# Altium project ArmbandControllerHardware_RevA.PrjPcb
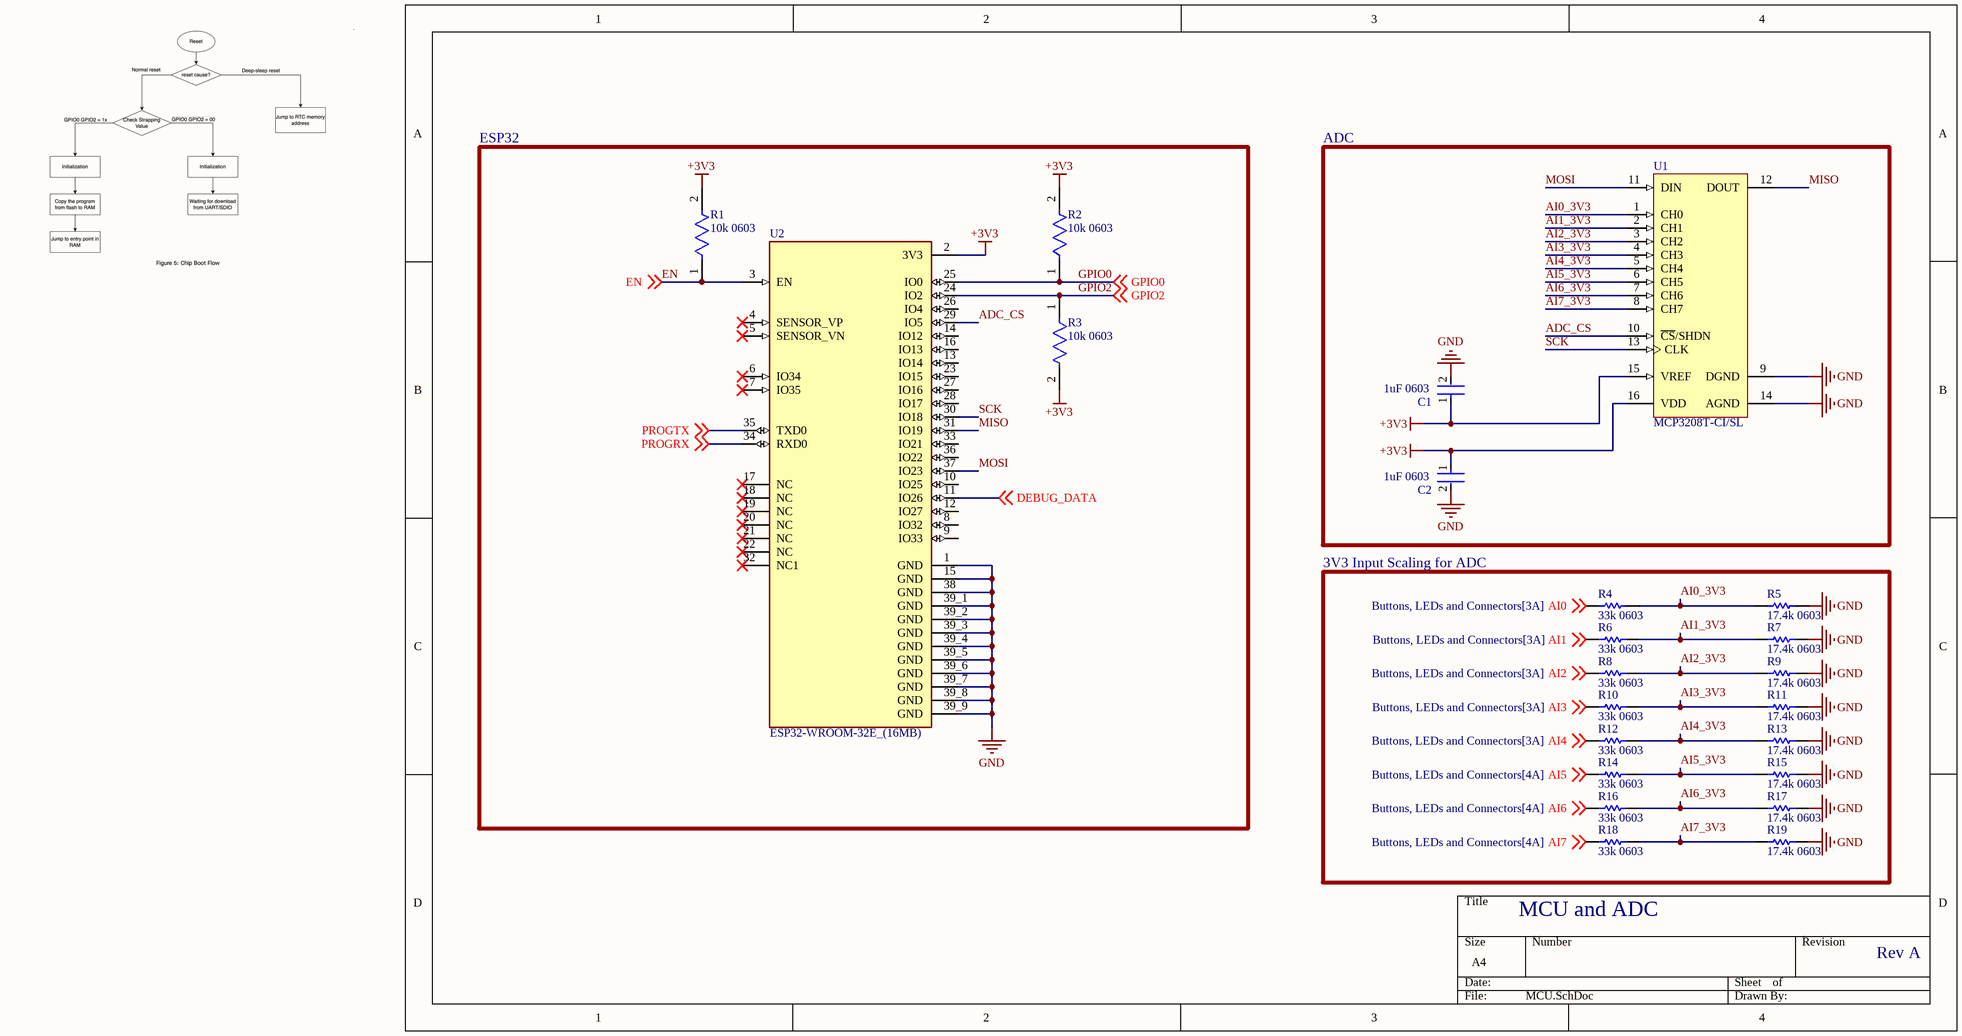
[diagram p0: MCU.SchDoc]
3 sheets, 48 parts. Net scope: global (net labels, ports and power ports of the same name join across sheets).
Board file: ArmbandControllerHardware PCB_RevA.PcbDoc
Sheets:
  MCU.SchDoc
  Buttons, LEDs and Connectors.SchDoc
  Power Schematic.SchDoc

## Sheet MCU.SchDoc
size A4; SheetNumber: 1; SheetTotal: 3

### Parts
C1  1uF 0603  [FP-CC0603-DA-MFG]
C2  1uF 0603  [FP-CC0603-DA-MFG]
R1  10k 0603  [FP-RC0603-0_55-IPC_C]
R2  10k 0603  [FP-RC0603-0_55-IPC_C]
R3  10k 0603  [FP-RC0603-0_55-IPC_C]
R4  33k 0603  [RESC1608X55X25LL10T15]
R5  17.4k 0603  [RESC1608X55X25NL10T15]
R6  33k 0603  [RESC1608X55X25LL10T15]
R7  17.4k 0603  [RESC1608X55X25NL10T15]
R8  33k 0603  [RESC1608X55X25LL10T15]
R9  17.4k 0603  [RESC1608X55X25NL10T15]
R10  33k 0603  [RESC1608X55X25LL10T15]
R11  17.4k 0603  [RESC1608X55X25NL10T15]
R12  33k 0603  [RESC1608X55X25LL10T15]
R13  17.4k 0603  [RESC1608X55X25NL10T15]
R14  33k 0603  [RESC1608X55X25LL10T15]
R15  17.4k 0603  [RESC1608X55X25NL10T15]
R16  33k 0603  [RESC1608X55X25LL10T15]
R17  17.4k 0603  [RESC1608X55X25NL10T15]
R18  33k 0603  [RESC1608X55X25LL10T15]
R19  17.4k 0603  [RESC1608X55X25NL10T15]
U1  MCP3208T-CI/SL  [SOIC-SL16_L]
U2  ESP32-WROOM-32E_(16MB)  [XCVR_ESP32-WROOM-32E_(16MB)]

### Blocks framed on the sheet
ESP32: R1-R3 U2
ADC: C1 C2 U1
3V3 Input Scaling for ADC: R4-R19

### Nets
+3V3: C1.1 C2.1 R1.2 R2.2 R3.2 U1.15(VREF) U1.16(VDD) U2.2(3V3)
GND: C1.2 C2.2 R5.1 R7.1 R9.1 R11.1 R13.1 R15.1 R17.1 R19.1 U1.9(DGND) U1.14(AGND) U2.1(GND) U2.15(GND) U2.38(GND) U2.39_1(GND) U2.39_2(GND) U2.39_3(GND) U2.39_4(GND) U2.39_5(GND) U2.39_6(GND) U2.39_7(GND) U2.39_8(GND) U2.39_9(GND)
ADC_CS: U1.10(~{CS}/SHDN) U2.29(IO5)
AI0: R4.1 ; off-sheet AI0
AI0_3V3: R4.2 R5.2 U1.1(CH0)
AI1: R6.1 ; off-sheet AI1
AI1_3V3: R6.2 R7.2 U1.2(CH1)
AI2: R8.1 ; off-sheet AI2
AI2_3V3: R8.2 R9.2 U1.3(CH2)
AI3: R10.1 ; off-sheet AI3
AI3_3V3: R10.2 R11.2 U1.4(CH3)
AI4: R12.1 ; off-sheet AI4
AI4_3V3: R12.2 R13.2 U1.5(CH4)
AI5: R14.1 ; off-sheet AI5
AI5_3V3: R14.2 R15.2 U1.6(CH5)
AI6: R16.1 ; off-sheet AI6
AI6_3V3: R16.2 R17.2 U1.7(CH6)
AI7: R18.1 ; off-sheet AI7
AI7_3V3: R18.2 R19.2 U1.8(CH7)
DEBUG_DATA: U2.11(IO26) ; off-sheet DEBUG_DATA
EN: R1.1 U2.3(EN) ; off-sheet EN
GPIO0: R2.1 U2.25(IO0) ; off-sheet GPIO0
GPIO2: R3.1 U2.24(IO2) ; off-sheet GPIO2
MISO: U1.12(DOUT) U2.31(IO19)
MOSI: U1.11(DIN) U2.37(IO23)
PROGRX: U2.34(RXD0) ; off-sheet PROGRX
PROGTX: U2.35(TXD0) ; off-sheet PROGTX
SCK: U1.13(CLK) U2.30(IO18)

Not connected (* = marked no-connect by the designer): U2 4(SENSOR_VP)* 5(SENSOR_VN)* 6(IO34)* 7(IO35)* 8(IO32) 9(IO33) 10(IO25) 12(IO27) 13(IO14) 14(IO12) 16(IO13) 17(NC)* 18(NC)* 19(NC)* 20(NC)* 21(NC)* 22(NC)* 23(IO15) 26(IO4) 27(IO16) 28(IO17) 32(NC1)* 33(IO21) 36(IO22)

### Notes on the sheet
- MCU and ADC
- Rev A

### Library data of the parts
C1 C2 = CMP-03422-000612-1: CAP CER 1UF 25V X5R 0603; Manufacturer: YAGEO; Manufacturer Part Number: CC0603KRX5R8BB105; Material: Ceramic; Tolerance: 0.1; Temperature Coefficient: 15%; Automotive: No; Octopart: https://octopart.com/cc0603krx5r8bb105-yageo-9292811; Package: CC0603-DA; Temperature Range High: +125°C; Digikey Description: CAP CER 1UF 25V X5R 0603; Mouser Description: Multilayer Ceramic Capacitors MLCC - SMD/SMT 1.0uF 25V X5R 10%; Device Class L2: Capacitors; Category: Cap; Value: 1 uF; Temperature: -55°C to +125°C; ComponentLink2URL: http://www.yageo.com/documents/recent/UPY-GPHC_X7R_6.3V-to-50V_18.pdf; Capacitance: 1 uF; ComponentLink2Description: Datasheet; Voltage: 25 V; Height: 0.9mm; Device Class L3: Ceramic Capacitors; Temperature Characteristic: X5R; Footprint Url: http://www.yageo.com/exep/pages/download/literatures/UPY-C_GEN_24.pdf; Temperature Range Low: -55°C; Device Class L1: Passive Components; Voltage Rating: 25 V; Lead Free: Yes; RoHS: TRUE
R1-R3 = CMP-2100-03664-2: RES 10K OHM 1% 1/10W 0603; Voltage Rating: 75V; Voltage Rating (DC): 50V; Resistance: 10kR; Power Rating: 100mW; Temperature Coefficient: 100ppm/°C; Depth: 0.8mm; Termination: SMD/SMT; Resistor Type: Thick Film; Series: RC; Construction: Rectangular; Features: Moisture Resistant; Packaging: Tape and Reel; Min Operating Temperature: -55°C; Number of Terminations: 2; Lead Pitch: 0.3mm; RoHS Compliant: Yes; Case/Package: 0603; Resistance Tolerance: 1%; Military Standard: Not; Weight: 7.1E-05oz; Number of Pins: 2; Tolerance: 1%; Length: 1.6mm; Case Code (Imperial): 0603; Lead Free: Lead Free; Width: 0.8mm; Max Power Dissipation: 100mW; Height: 0.45mm; Max Operating Temperature: 155°C; Case Code (Metric): 1608; Size Code: 0603
R4 R6 R8 R10 R12 R14 R16 R18 = CMP-2000-06939-1: Chip Resistor, 33 Ohm, +/- 1%, 0.1 W, -55 to 155 degC, 0603 (1608 Metric), RoHS, Tape and Reel; Temperature Coefficient: 100PPM/C; Voltage Rating: 75V; Unit Weight: 0.000071oz; Power Rating: 100mW; Brand: Yageo; Resistance: 33Ohms; Product Category: ThickFilmResistors; Packaging: Reel; Tolerance: 1%; RoHS: True; Height: 0.45mm; Case Code - mm: 1608; Series: RC; Datasheet URL: http://www.yageo.com/documents/recent/PYu-RC_Group_51_RoHS_L_7.pdf; Operating Temperature Range: -55Cto+155C; Type: GeneralPurposeChipResistorSurfaceMount; Product: ThickFilmResistorsGeneralPurpose; Package / Case: 0603(1608metric); Width: 0.8mm; Length: 1.6mm; Case Code - in: 0603; Mounting Technology: SurfaceMount; Manufacturer URL: http://www.yageo.com/; Manufacturer: Yageo; Package Reference: 0603; Termination Style: SMD/SMT; Datasheet Version: Rev. 7, 05/2017; Package Description: 2-Pin Surface Mount Device, Body 1.6 x 0.8 mm
R5 R7 R9 R11 R13 R15 R17 R19 = CMP-2000-03920-1: Part Number: RC0603FR-0717K4L; Manufacturer: Yageo
U1 = CMP-0188-00450-2: 2.7V 4-Channel/8-Channel 12-Bit A/D Converters with SPI Serial Interface, 16-Pin SOIC 150mil, C Performance Grade, Industrial Temperature, Tape and Reel; PackageDescription: 16-Lead Plastic Small Outline (SL) - Narrow, 3.90mm Body [SOIC]; ComponentLink3Description: Package Specification; PackageReference: SOIC-SL16; ComponentLink1Description: Manufacturer URL; ComponentLink2URL: http://ww1.microchip.com/downloads/en/DeviceDoc/21298e.pdf; ComponentLink1URL: http://www.microchip.com/; Code_JEDEC: MS-012-AC; ComponentLink3URL: http://www.microchip.com/stellent/groups/techpub_sg/documents/packagingspec/en012702.pdf; Code_IPC: SOIC127P600-16; ComponentLink2Description: Datasheet; RevisionNote: URLs added.; PackageVersion: revBB, Aug-2009; DatasheetVersion: revE, Sep-2008
U2 = ESP32-WROOM-32E_(16MB): MF: {'manufacturer': u'Espressif Systems'}; Package: None; Price: None; Value: *; MP: ESP32-WROOM-32E_(16MB); Availability: Unavailable

## Sheet Buttons, LEDs and Connectors.SchDoc
size A4; SheetNumber: 2; SheetTotal: 3
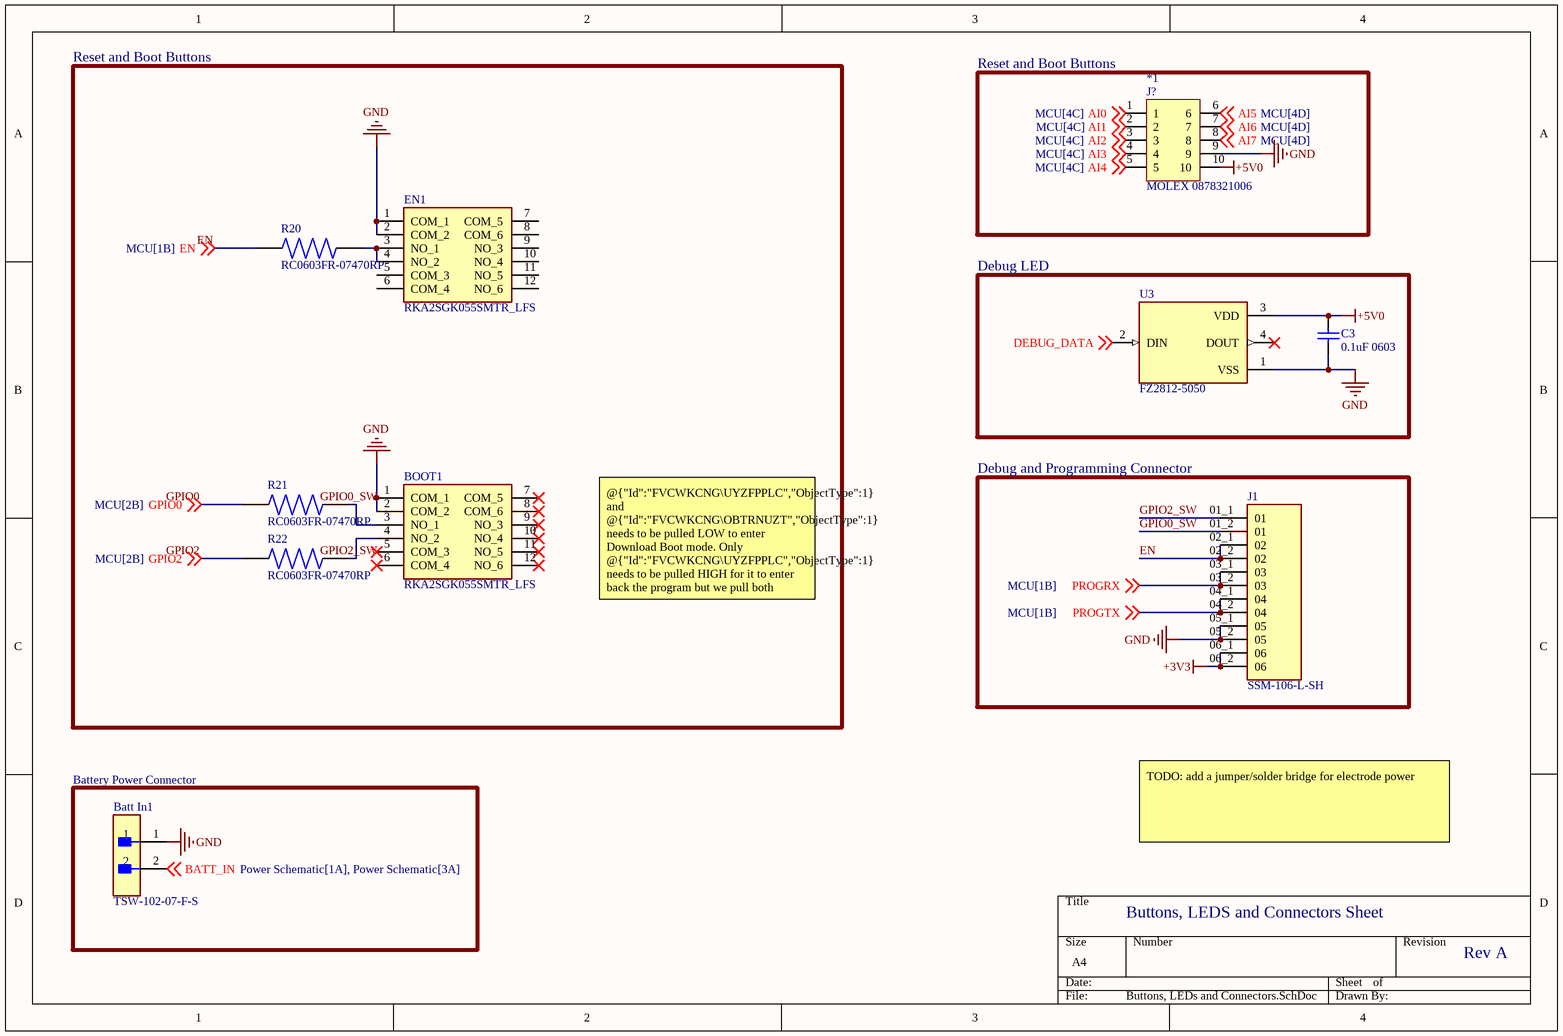
[diagram p1: Buttons, LEDs and Connectors.SchDoc]

### Parts
*1  MOLEX 0878321006  [MOLEX 0878321006]
Batt_In1  TSW-102-07-F-S  [FP-TSW-102-07-F-S-MFG]
BOOT1  RKA2SGK055SMTR_LFS  [RKA2SGK055SMTRLFS]
C3  0.1uF 0603  [CAPC1608X90X40LL10T20]
EN1  RKA2SGK055SMTR_LFS  [RKA2SGK055SMTRLFS]
J1  SSM-106-L-SH  [SAMTEC_SSM-106-L-SH]
R20  RC0603FR-07470RP  [RESC1608X55N]
R21  RC0603FR-07470RP  [RESC1608X55N]
R22  RC0603FR-07470RP  [RESC1608X55N]
U3  FZ2812-5050  [LED_FZ2812-5050]

### Blocks framed on the sheet
Reset and Boot Buttons: BOOT1 EN1 R20-R22
Reset and Boot Buttons: *1
Debug LED: C3 U3
Debug and Programming Connector: J1
Battery Power Connector: Batt_In1

### Nets
+3V3: J1.06_1(06) J1.06_2(06)
+5V0: *1.10 C3.2 U3.3(VDD)
GND: *1.9 Batt_In1.1 BOOT1.1(COM_1) BOOT1.2(COM_2) C3.1 EN1.1(COM_1) EN1.2(COM_2) J1.05_1(05) J1.05_2(05) U3.1(VSS)
AI0: *1.1 ; off-sheet AI0
AI1: *1.2 ; off-sheet AI1
AI2: *1.3 ; off-sheet AI2
AI3: *1.4 ; off-sheet AI3
AI4: *1.5 ; off-sheet AI4
AI5: *1.6 ; off-sheet AI5
AI6: *1.7 ; off-sheet AI6
AI7: *1.8 ; off-sheet AI7
BATT_IN: Batt_In1.2 ; off-sheet BATT_IN
DEBUG_DATA: U3.2(DIN) ; off-sheet DEBUG_DATA
EN: J1.02_1(02) J1.02_2(02) R20.2 ; off-sheet EN
GPIO0: R21.2 ; off-sheet GPIO0
GPIO0_SW: BOOT1.3(NO_1) J1.01_2(01) R21.1
GPIO2: R22.2 ; off-sheet GPIO2
GPIO2_SW: BOOT1.4(NO_2) J1.01_1(01) R22.1
PROGRX: J1.03_1(03) J1.03_2(03) ; off-sheet PROGRX
PROGTX: J1.04_1(04) J1.04_2(04) ; off-sheet PROGTX
NetEN1_3: EN1.3(NO_1) EN1.4(NO_2) R20.1

Not connected (* = marked no-connect by the designer): BOOT1 5(COM_3)* 6(COM_4)* 7(COM_5)* 8(COM_6)* 9(NO_3)* 10(NO_4)* 11(NO_5)* 12(NO_6)*; EN1 5(COM_3) 6(COM_4) 7(COM_5) 8(COM_6) 9(NO_3) 10(NO_4) 11(NO_5) 12(NO_6); U3 4(DOUT)*

### Notes on the sheet
- @{"Id":"FVCWKCNG\UYZFPPLC","ObjectType":1} and @{"Id":"FVCWKCNG\OBTRNUZT","ObjectType":1}
  needs to be pulled LOW to enter Download Boot mode. Only @{"Id":"FVCWKCNG\UYZFPPLC","ObjectType":1} needs to be pulled HIGH for it to enter back the program but we pull both @{"Id":"FVCWKCNG\UYZFPPLC","ObjectType":1} and @{"Id":"FVCWKCNG\OBTRNUZT","ObjectType":1} HIGH for simplicity
- TODO: add a jumper/solder bridge for electrode power
- Buttons, LEDS and Connectors Sheet
- Rev A
- (in symbol MOLEX 0878321006) J?

### Library data of the parts
Batt_In1 = CMP-02766-001458-1: CONN HEADER VERT 2POS 2.54MM; Gender: Male; Max Current Rating: 7.6A; Number of Contacts: 2; Max Voltage Rating (AC): 550V; Orientation: Straight; Depth: 2.54mm; Series: TSW; Package Quantity: 1; Min Operating Temperature: -55°C; Max Operating Temperature: 125°C; Contact Type: Male Pin; Contact Shape: Square; Color: Black; Housing Color: Black; Connector Type: Header; Fastening Type: Pull; Radiation Hardening: No; Pitch: 2.54mm; Housing Material: Polyester; Mount: Through Hole; Number of Positions: 2; Number of Rows: 1; Contact Material: Bronze; Insulation Color: Black; Contact Finish - Mating: GOLD; Termination: Solder; Insulation Material: PBT; Length: 5.08mm; Flammability Rating: UL94 V-0; Contact Mating Length: 0.23inch; REACH SVHC: No SVHC; Contact Plating: Gold; RoHS Compliant: Yes; Packaging: Bulk
BOOT1 EN1 = RKA2SGK055SMTR_LFS: Switch; Manufacturer_Name: C & K COMPONENTS; Manufacturer_Part_Number: RKA2SGK055SMTR LFS; Datasheet Link: https://www.ckswitches.com/media/3130/ck_rk_datasheet.pdf; Height: 0.55mm; Mouser Part Number: 611-RKA2SGK055SMTRLF; Mouser Price/Stock: https://www.mouser.co.uk/ProductDetail/CK/RKA2SGK055SMTR-LFS?qs=iLbezkQI%252BsiGAt%252Bzcl2zSQ%3D%3D; Arrow Part Number: RKA2SGK055SMTR LFS; Arrow Price/Stock: https://www.arrow.com/en/products/rka2sgk055smtr-lfs/ck?region=europe
C3 = CMP-1035-02594-2: Chip Capacitor, 100 nF, - 20% to + 80%, 50 V, -30 to 85 degC, 0603 (1608 Metric), RoHS, Tape and Reel; Manufacturer: Yageo; Tolerance: -20%,+80%; Capacitance: 0.1µF; Product Training Modules: MultilayerCeramicCapacitors; Temperature Coefficient: Y5V(F); Kits: CC060300000000000-ND-MLCC0603SAMPLEKIT; Other Names: 311-1343-1; Featured Product: CommodityMultilayerCeramicCapacitors–CCSeries; Online Catalog: CCSeries; Voltage - Rated: 50V; Mounting Type: SurfaceMount,MLCC; Package Description: 2-Pin Surface Mount Device, Body 1.6 x 0.8 mm; Ratings: -; Lead Spacing: -; Standard Package: 1; Applications: GeneralPurpose; Size / Dimension: 0.063"Lx0.031"W(1.60mmx0.80mm); Package Reference: 0603; Operating Temperature: -30°C~85°C; Features: -; Height - Seated (Max): -; Thickness (Max): 0.035"(0.90mm); Series: CC; Datasheet URL: https://datasheet.ciiva.com/17434/upy-gphc-y5v-6-3v-to-50v-5-17434523.pdf; Family: CeramicCapacitors; Mounting Technology: SurfaceMount; Packaging: CutTape(CT); Package / Case: 0603(1608Metric); Manufacturer URL: http://www.yageo.com/; Category: Capacitors; Lead Style: -; Datasheet Version: Rev. 5, 07/2010
J1 = SSM-106-L-SH: MF: {'manufacturer': u'Samtec'}; Package: None; Price: None; Value: *; MP: SSM-106-L-SH; Availability: Unavailable
R20-R22 = RC0603FR-07470RP: RES SMD 470 OHM 1% 1/10W 0603; MF: {'manufacturer': u'Yageo Corporation'}; Package: None; Price: None; Value: *; MP: RC0603FR-07470RP; Availability: Unavailable
U3 = FZ2812-5050: MF: {'manufacturer': u'Feztek'}; Package: None; Price: None; Value: *; MP: FZ2812-5050; Availability: Unavailable

## Sheet Power Schematic.SchDoc
size A4; SheetNumber: 3; SheetTotal: 3
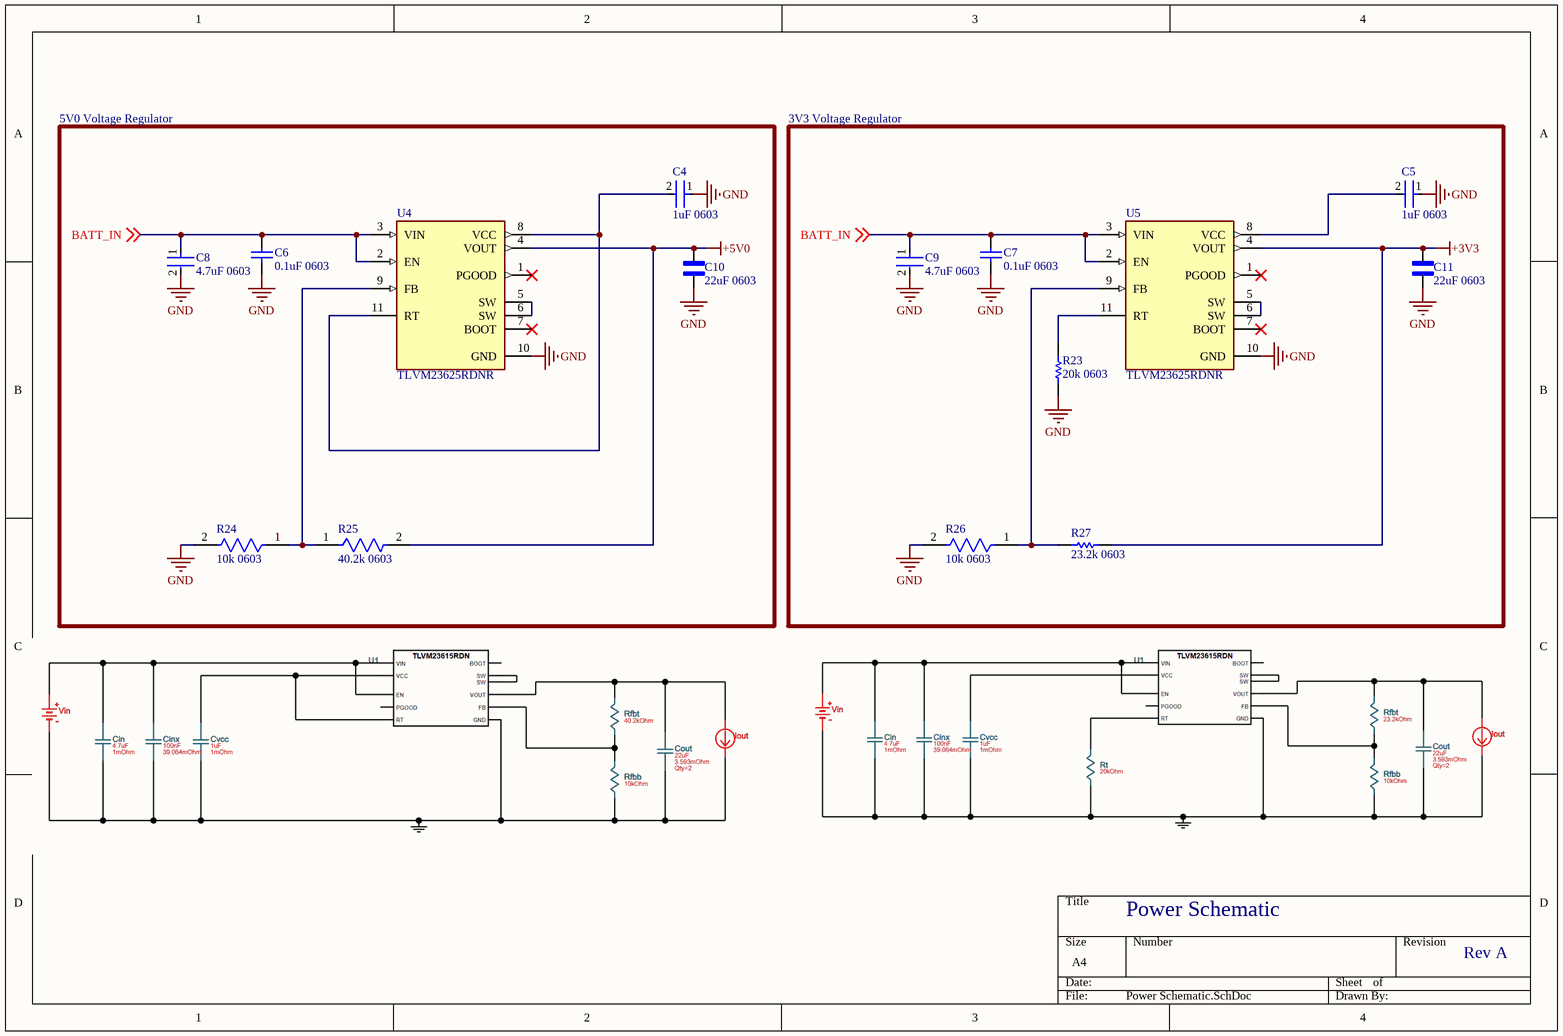
[diagram p2: Power Schematic.SchDoc]

### Parts
C4  1uF 0603  [FP-CC0603-DA-MFG]
C5  1uF 0603  [FP-CC0603-DA-MFG]
C6  0.1uF 0603  [CAPC1608X90X40LL10T20]
C7  0.1uF 0603  [CAPC1608X90X40LL10T20]
C8  4.7uF 0603  [FP-CC0603-DA-MFG]
C9  4.7uF 0603  [FP-CC0603-DA-MFG]
C10  22uF 0603  [CAPC1608X90]
C11  22uF 0603  [CAPC1608X90]
R23  20k 0603  [RESC1608X55X25NL10T15]
R24  10k 0603  [FP-RC0603-0_55-IPC_C]
R25  40.2k 0603  [FP-RC0603-0_55-IPC_C]
R26  10k 0603  [FP-RC0603-0_55-IPC_C]
R27  23.2k 0603  [RESC1608X55X25NL10T15]
U4  TLVM23625RDNR  [CONV_TLVM23625RDNR]
U5  TLVM23625RDNR  [CONV_TLVM23625RDNR]

### Blocks framed on the sheet
5V0 Voltage Regulator: C4 C6 C8 C10 R24 R25 U4
3V3 Voltage Regulator: C5 C7 C9 C11 R23 R26 R27 U5

### Nets
+3V3: C11.1 R27.2 U5.4(VOUT)
+5V0: C10.1 R25.2 U4.4(VOUT)
GND: C4.1 C5.1 C6.1 C7.1 C8.2 C9.2 C10.2 C11.2 R23.1 R24.2 R26.2 U4.10(GND) U5.10(GND)
BATT_IN: C6.2 C7.2 C8.1 C9.1 U4.2(EN) U4.3(VIN) U5.2(EN) U5.3(VIN) ; off-sheet BATT_IN
NetC4_2: C4.2 U4.8(VCC) U4.11(RT)
NetC5_2: C5.2 U5.8(VCC)
NetR23_2: R23.2 U5.11(RT)
NetR24_1: R24.1 R25.1 U4.9(FB)
NetR26_1: R26.1 R27.1 U5.9(FB)
NetU4_5: U4.5(SW) U4.6(SW)
NetU5_5: U5.5(SW) U5.6(SW)

Not connected (* = marked no-connect by the designer): U4 1(PGOOD)* 7(BOOT)*; U5 1(PGOOD)* 7(BOOT)*

### Notes on the sheet
- Power Schematic
- Rev A

### Library data of the parts
C4 C5 = CMP-03422-000612-1: as C1 on sheet MCU; Automotive: No; Octopart: https://octopart.com/cc0603krx5r8bb105-yageo-9292811; Package: CC0603-DA; Temperature Range High: +125°C; Digikey Description: CAP CER 1UF 25V X5R 0603; Mouser Description: Multilayer Ceramic Capacitors MLCC - SMD/SMT 1.0uF 25V X5R 10%; Device Class L2: Capacitors; Category: Cap; Value: 1 uF; Temperature: -55°C to +125°C; ComponentLink2URL: http://www.yageo.com/documents/recent/UPY-GPHC_X7R_6.3V-to-50V_18.pdf; Capacitance: 1 uF; ComponentLink2Description: Datasheet; Voltage: 25 V; Height: 0.9mm; Device Class L3: Ceramic Capacitors; Temperature Characteristic: X5R; Footprint Url: http://www.yageo.com/exep/pages/download/literatures/UPY-C_GEN_24.pdf; Temperature Range Low: -55°C; Device Class L1: Passive Components; Voltage Rating: 25 V; Lead Free: Yes; RoHS: TRUE
C6 C7 = CMP-1035-02594-2: as C3 on sheet Buttons, LEDs and Connectors; Mounting Type: SurfaceMount,MLCC; Package Description: 2-Pin Surface Mount Device, Body 1.6 x 0.8 mm; Ratings: -; Lead Spacing: -; Standard Package: 1; Applications: GeneralPurpose; Size / Dimension: 0.063"Lx0.031"W(1.60mmx0.80mm); Package Reference: 0603; Operating Temperature: -30°C~85°C; Features: -; Height - Seated (Max): -; Thickness (Max): 0.035"(0.90mm); Series: CC; Datasheet URL: https://datasheet.ciiva.com/17434/upy-gphc-y5v-6-3v-to-50v-5-17434523.pdf; Family: CeramicCapacitors; Mounting Technology: SurfaceMount; Packaging: CutTape(CT); Package / Case: 0603(1608Metric); Manufacturer URL: http://www.yageo.com/; Category: Capacitors; Lead Style: -; Datasheet Version: Rev. 5, 07/2010
C8 C9 = CMP-03422-001236-1: CAP CER 4.7UF 16V X5R 0603; Manufacturer: YAGEO; Manufacturer Part Number: CC0603KRX5R7BB475; Temperature Coefficient: 15%; Material: Ceramic; Tolerance: 0.1; Temperature Characteristic: X5R; Footprint Url: http://www.yageo.com/exep/pages/download/literatures/UPY-C_GEN_24.pdf; ComponentLink2URL: http://www.yageo.com/documents/recent/UPY-GPHC_X7R_6.3V-to-50V_18.pdf; ComponentLink2Description: Datasheet; Device Class L3: Ceramic Capacitors; Category: Cap; Voltage Rating: 16 V; Automotive: No; Temperature Range High: +125°C; Value: 4.7 uF; Device Class L1: Passive Components; RoHS: TRUE; Device Class L2: Capacitors; Voltage: 16 V; Height: 0.9mm; Temperature Range Low: -55°C; Temperature: -55°C to +125°C; Capacitance: 4.7 uF; Mouser Description: Multilayer Ceramic Capacitors MLCC - SMD/SMT 4.7uF 16V X5R 10%; Octopart: https://octopart.com/cc0603krx5r7bb475-yageo-34978295; Package: CC0603-DA; Lead Free: Yes; Digikey Description: CAP CER 4.7UF 16V X5R 0603
C10 C11 = CC0603MRX5R6BB226: Cap Ceramic 22uF 10V X5R 20% SMD 0603 85Â°C Paper T/R; MF: {'manufacturer': u'Yageo'}; Package: None; Price: None; Value: *; MP: CC0603MRX5R6BB226; Availability: Unavailable
R23 = CMP-2000-04254-1: Part Number: RC0603JR-0720RL; Manufacturer: Yageo
R24 R26 = CMP-2100-03664-2: as R1 on sheet MCU; Depth: 0.8mm; Termination: SMD/SMT; Resistor Type: Thick Film; Series: RC; Construction: Rectangular; Features: Moisture Resistant; Packaging: Tape and Reel; Min Operating Temperature: -55°C; Number of Terminations: 2; Lead Pitch: 0.3mm; RoHS Compliant: Yes; Case/Package: 0603; Resistance Tolerance: 1%; Military Standard: Not; Weight: 7.1E-05oz; Number of Pins: 2; Tolerance: 1%; Length: 1.6mm; Case Code (Imperial): 0603; Lead Free: Lead Free; Width: 0.8mm; Max Power Dissipation: 100mW; Height: 0.45mm; Max Operating Temperature: 155°C; Case Code (Metric): 1608; Size Code: 0603
R25 = CMP-03412-037816-1: RES 40.2K OHM 1% 1/10W 0603; Power Rating: 100mW; Resistance: 40.2kR; Voltage Rating: 50V; Working Voltage: 75V; Temperature Coefficient: 100ppm/°C; Construction: Rectangular; RoHS Compliant: Yes; Military Standard: Not; Min Operating Temperature: -55°C; Resistor Type: Thick Film; Depth: 0.8mm; Features: Moisture Resistant; Case Code (Imperial): 0603; Number of Terminations: 2; Series: RC; Width: 0.8mm; Height: 0.45mm; Packaging: Tape and Reel; Length: 1.6mm; Case Code (Metric): 1608; Termination: SMD/SMT; Max Operating Temperature: 155°C; Voltage Rating (DC): 50V; Max Power Dissipation: 100mW; Tolerance: 1%; Case/Package: 0603; Lead Free: Lead Free; Technology: METAL OXIDE FILM; Mount: Surface Mount
R27 = CMP-2000-03962-1: Part Number: RC0603FR-0723K2L; Manufacturer: Yageo
U4 U5 = TLVM23625RDNR: MF: {'manufacturer': u'Texas Instruments'}; Package: None; Price: None; Value: *; MP: TLVM23625RDNR; Availability: Unavailable

## Nets that join several sheets
+3V3: MCU (8 pins), Buttons, LEDs and Connectors (J1.06_1 J1.06_2), Power Schematic (C11.1 R27.2 U5.4)
+5V0: Buttons, LEDs and Connectors (*1.10 C3.2 U3.3), Power Schematic (C10.1 R25.2 U4.4)
GND: MCU (24 pins), Buttons, LEDs and Connectors (10 pins), Power Schematic (13 pins)
AI0: MCU (R4.1), Buttons, LEDs and Connectors (*1.1)
AI1: MCU (R6.1), Buttons, LEDs and Connectors (*1.2)
AI2: MCU (R8.1), Buttons, LEDs and Connectors (*1.3)
AI3: MCU (R10.1), Buttons, LEDs and Connectors (*1.4)
AI4: MCU (R12.1), Buttons, LEDs and Connectors (*1.5)
AI5: MCU (R14.1), Buttons, LEDs and Connectors (*1.6)
AI6: MCU (R16.1), Buttons, LEDs and Connectors (*1.7)
AI7: MCU (R18.1), Buttons, LEDs and Connectors (*1.8)
BATT_IN: Buttons, LEDs and Connectors (Batt_In1.2), Power Schematic (8 pins)
DEBUG_DATA: MCU (U2.11), Buttons, LEDs and Connectors (U3.2)
EN: MCU (R1.1 U2.3), Buttons, LEDs and Connectors (J1.02_1 J1.02_2 R20.2)
GPIO0: MCU (R2.1 U2.25), Buttons, LEDs and Connectors (R21.2)
GPIO2: MCU (R3.1 U2.24), Buttons, LEDs and Connectors (R22.2)
PROGRX: MCU (U2.34), Buttons, LEDs and Connectors (J1.03_1 J1.03_2)
PROGTX: MCU (U2.35), Buttons, LEDs and Connectors (J1.04_1 J1.04_2)